# Altium schematic sheet MCU_Block.SchDoc
size A4; SheetNumber: 2; SheetTotal: 9
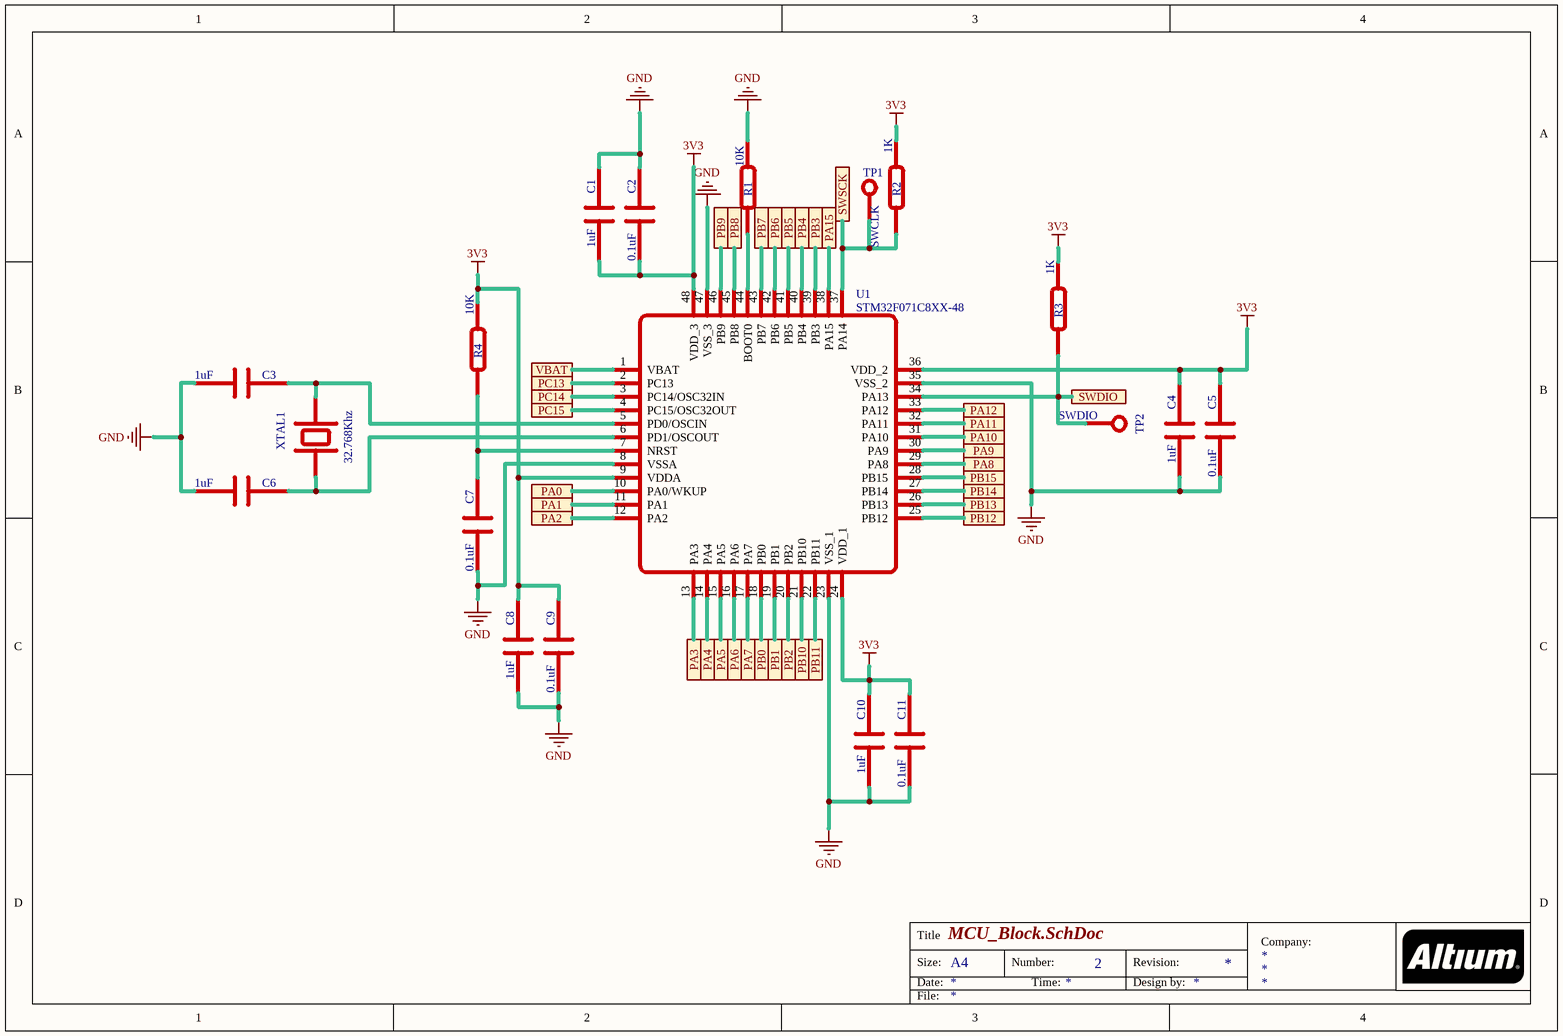
[diagram p0: MCU_Block.SchDoc]

## Parts
C1  1uF  [C0603]
C2  0.1uF  [C0603]
C3  1uF  [C0603]
C4  1uF  [C0603]
C5  0.1uF  [C0603]
C6  1uF  [C0603]
C7  0.1uF  [C0603]
C8  1uF  [C0603]
C9  0.1uF  [C0603]
C10  1uF  [C0603]
C11  0.1uF  [C0603]
R1  10K  [R0603]
R2  1K  [R0603]
R3  1K  [R0603]
R4  10K  [R0603]
TP1  SWCLK  [Test Point]
TP2  SWDIO  [Test Point]
U1  STM32F071C8XX-48  [LQFP48]
XTAL1  32.768Khz  [Crystal TH HC49]

## Ports
PA0, PA1, PA2, PA3, PA4, PA5, PA6, PA7, PA8, PA9, PA10, PA11, PA12, PA15, PB0, PB1, PB2, PB3, PB4, PB5, PB6, PB7, PB8, PB9, PB10, PB11, PB12, PB13, PB14, PB15, PC13, PC14, PC15, SWDIO, SWSCK, VBAT

## Nets
3V3: C1.1 C2.1 C4.2 C5.2 C8.2 C9.2 C10.2 C11.2 R2.2 R3.2 R4.2 U1.9(VDDA) U1.24(VDD_1) U1.36(VDD_2) U1.48(VDD_3)
GND: C1.2 C2.2 C3.1 C4.1 C5.1 C6.1 C7.1 C8.1 C9.1 C10.1 C11.1 R1.2 U1.8(VSSA) U1.23(VSS_1) U1.35(VSS_2) U1.47(VSS_3)
PA0: U1.10(PA0/WKUP) ; port PA0
PA1: U1.11(PA1) ; port PA1
PA2: U1.12(PA2) ; port PA2
PA3: U1.13(PA3) ; port PA3
PA4: U1.14(PA4) ; port PA4
PA5: U1.15(PA5) ; port PA5
PA6: U1.16(PA6) ; port PA6
PA7: U1.17(PA7) ; port PA7
PA8: U1.29(PA8) ; port PA8
PA9: U1.30(PA9) ; port PA9
PA10: U1.31(PA10) ; port PA10
PA11: U1.32(PA11) ; port PA11
PA12: U1.33(PA12) ; port PA12
PA15: U1.38(PA15) ; port PA15
PB0: U1.18(PB0) ; port PB0
PB1: U1.19(PB1) ; port PB1
PB2: U1.20(PB2) ; port PB2
PB3: U1.39(PB3) ; port PB3
PB4: U1.40(PB4) ; port PB4
PB5: U1.41(PB5) ; port PB5
PB6: U1.42(PB6) ; port PB6
PB7: U1.43(PB7) ; port PB7
PB8: U1.45(PB8) ; port PB8
PB9: U1.46(PB9) ; port PB9
PB10: U1.21(PB10) ; port PB10
PB11: U1.22(PB11) ; port PB11
PB12: U1.25(PB12) ; port PB12
PB13: U1.26(PB13) ; port PB13
PB14: U1.27(PB14) ; port PB14
PB15: U1.28(PB15) ; port PB15
PC13: U1.2(PC13) ; port PC13
PC14: U1.3(PC14/OSC32IN) ; port PC14
PC15: U1.4(PC15/OSC32OUT) ; port PC15
SWDIO: R3.1 TP2.1 U1.34(PA13) ; port SWDIO
SWSCK: R2.1 TP1.1 U1.37(PA14) ; port SWSCK
VBAT: U1.1(VBAT) ; port VBAT
NetC3_2: C3.2 U1.5(PD0/OSCIN) XTAL1.2
NetC6_2: C6.2 U1.6(PD1/OSCOUT) XTAL1.1
NetC7_2: C7.2 R4.1 U1.7(NRST)
NetR1_1: R1.1 U1.44(BOOT0)

## Notes on the sheet
- Title
- Size:
- Date:
- A4
- Number:
- Time:
- Revision:
- Design by:
- Company:
- File:

## Library data of the parts
C1-C11 = CAP-CER: Ceramic Capacitor
R1-R4 = Resistor
TP1 TP2 = TestPoint: Test Point
U1 = STM32F071C8XX-48: STM32F071C8T6-48Pin; ComponentLink1Description: STM32F071CxTx; ComponentLink1URL: https://www.st.com/resource/en/datasheet/stm32f071cb.pdf
XTAL1 = CRYSTAL-2P: Crystall 2Pin Capacitor Intergrated